# Altium schematic sheet PX4FMUv2.4.6_3.SchDoc
size 282 x 200 mm
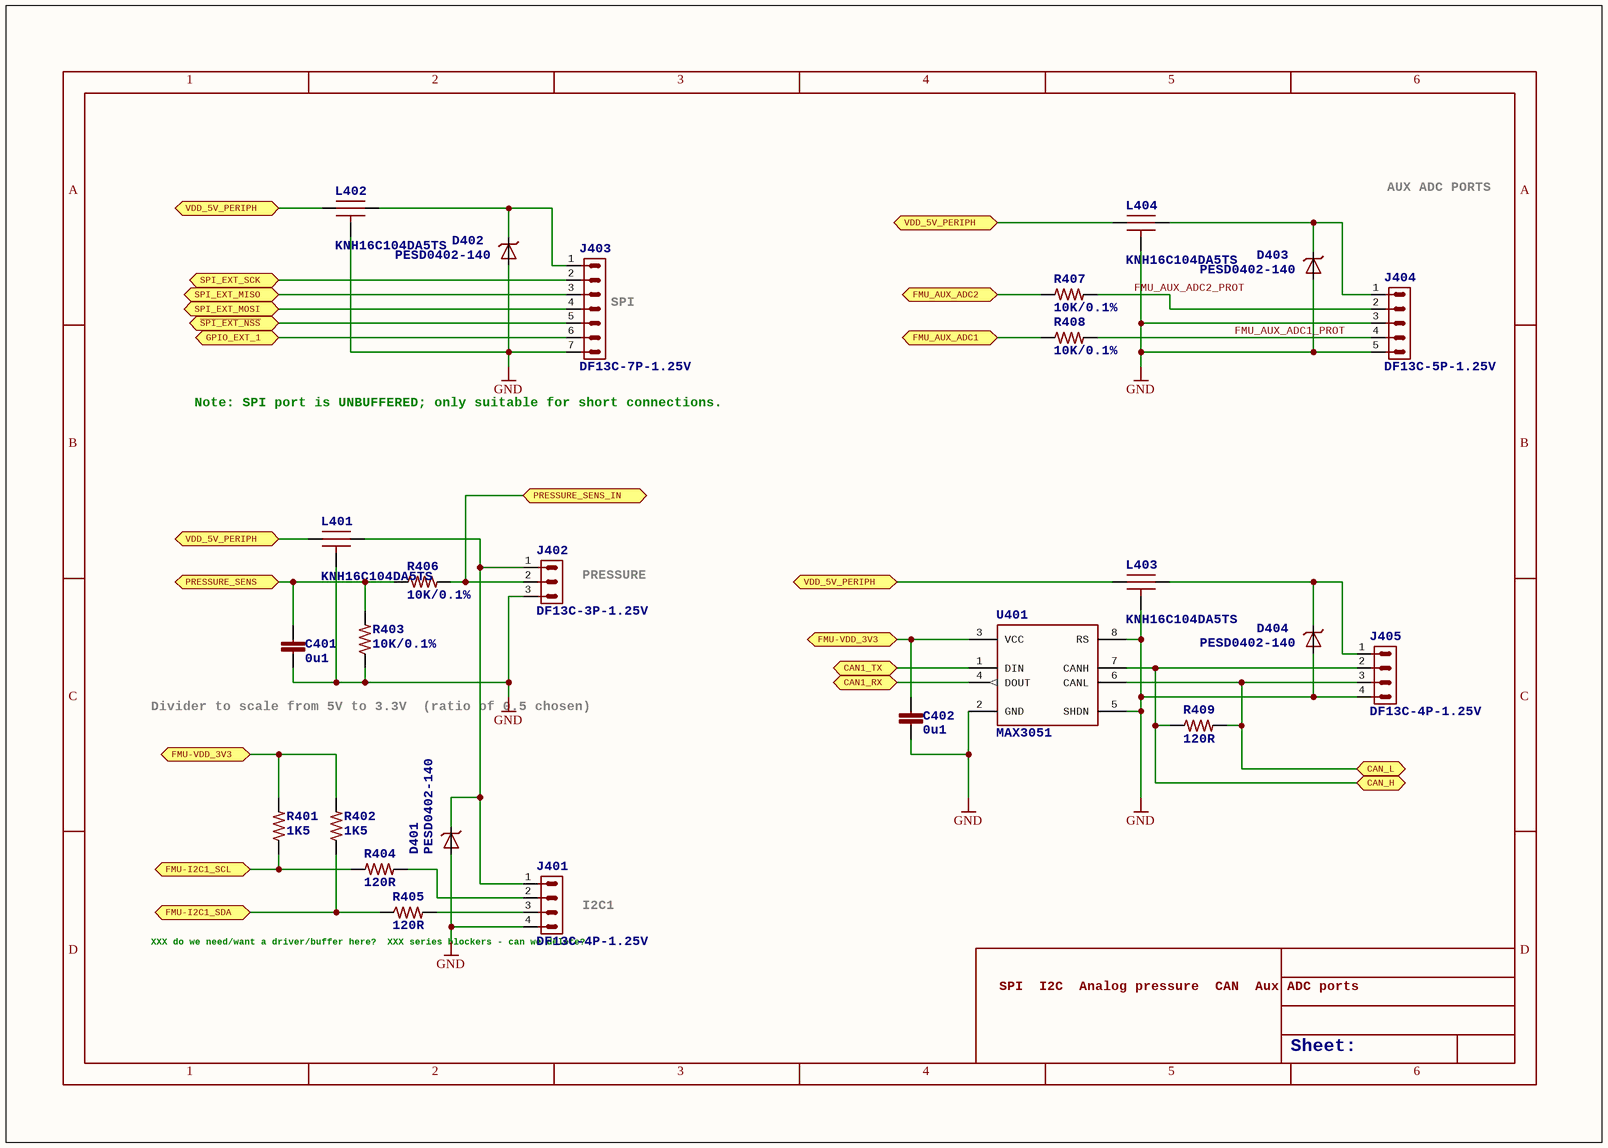
[diagram p0: PX4FMUv2.4.6_3.SchDoc]

## Parts
C401  0u1  [0402-CAP]
C402  0u1  [0402-CAP]
D401  PESD0402-140  [0402-TVS]
D402  PESD0402-140  [0402-TVS]
D403  PESD0402-140  [0402-TVS]
D404  PESD0402-140  [0402-TVS]
J401  DF13C-4P-1.25V  [DF13C-4P-1.25V]
J402  DF13C-3P-1.25V  [DF13C-3P-1.25V]
J403  DF13C-7P-1.25V  [DF13C-7P-1.25V]
J404  DF13C-5P-1.25V  [DF13C-5P-1.25V]
J405  DF13C-4P-1.25V  [DF13C-4P-1.25V]
L401  KNH16C104DA5TS  [KYOCERA-KNH16-DA]
L402  KNH16C104DA5TS  [KYOCERA-KNH16-DA]
L403  KNH16C104DA5TS  [KYOCERA-KNH16-DA]
L404  KNH16C104DA5TS  [KYOCERA-KNH16-DA]
R401  1K5  [0402-RES]
R402  1K5  [0402-RES]
R403  10K/0.1%  [0402-RES]
R404  120R  [0402-RES]
R405  120R  [0402-RES]
R406  10K/0.1%  [0402-RES]
R407  10K/0.1%  [0402-RES]
R408  10K/0.1%  [0402-RES]
R409  120R  [0402-RES]
U401  MAX3051  [SOT23-8]

## Ports
CAN1_RX, CAN1_TX, CAN_H, CAN_L, FMU-I2C1_SCL, FMU-I2C1_SDA, FMU-VDD_3V3, FMU_AUX_ADC1, FMU_AUX_ADC2, GPIO_EXT_1, PRESSURE_SENS, PRESSURE_SENS_IN, SPI_EXT_MISO, SPI_EXT_MOSI, SPI_EXT_SCK, VDD_5V_PERIPH, ~{SPI_EXT_NSS}

## Nets
GND: C401.P$2 C402.P$2 D401.A D402.A D403.A D404.A J401.4 J402.3 J403.7 J404.3 J404.5 J405.4 L401.P$3_P$4_P$5(P$3) L402.P$3_P$4_P$5(P$3) L403.P$3_P$4_P$5(P$3) L404.P$3_P$4_P$5(P$3) R403.P$1 U401.2(GND) U401.5(SHDN) U401.8(RS)
CAN1_RX: U401.4(DOUT) ; port CAN1_RX
CAN1_TX: U401.1(DIN) ; port CAN1_TX
CAN_H: J405.2 R409.P$1 U401.7(CANH) ; port CAN_H
CAN_L: J405.3 R409.P$2 U401.6(CANL) ; port CAN_L
FMU-I2C1_SCL: R401.P$1 R404.P$1 ; port FMU-I2C1_SCL
FMU-I2C1_SDA: R402.P$1 R405.P$1 ; port FMU-I2C1_SDA
FMU-VDD_3V3: C402.P$1 R401.P$2 R402.P$2 U401.3(VCC) ; port FMU-VDD_3V3
FMU_AUX_ADC1: R408.P$1 ; port FMU_AUX_ADC1
FMU_AUX_ADC1_PROT: J404.4 R408.P$2
FMU_AUX_ADC2: R407.P$1 ; port FMU_AUX_ADC2
FMU_AUX_ADC2_PROT: J404.2 R407.P$2
GPIO_EXT_1: J403.6 ; port GPIO_EXT_1
PRESSURE_SENS: C401.P$1 R403.P$2 R406.P$1 ; port PRESSURE_SENS
PRESSURE_SENS_IN: J402.2 R406.P$2 ; port PRESSURE_SENS_IN
~{SPI_EXT_NSS}: J403.5 ; port ~{SPI_EXT_NSS}
SPI_EXT_MISO: J403.3 ; port SPI_EXT_MISO
SPI_EXT_MOSI: J403.4 ; port SPI_EXT_MOSI
SPI_EXT_SCK: J403.2 ; port SPI_EXT_SCK
VDD_5V_PERIPH: L401.P$1 L402.P$1 L403.P$1 L404.P$1 ; port VDD_5V_PERIPH
NetD401_C: D401.C J401.1 J402.1 L401.P$2
NetD402_C: D402.C J403.1 L402.P$2
NetD403_C: D403.C J404.1 L404.P$2
NetD404_C: D404.C J405.1 L403.P$2
NetJ401_2: J401.2 R404.P$2
NetJ401_3: J401.3 R405.P$2

## Notes on the sheet
- AUX ADC PORTS
- (near J403) SPI
- (near J403) Note: SPI port is UNBUFFERED; only suitable for short connections.
- (near J402) PRESSURE
- Divider to scale from 5V to 3.3V
  (ratio of 0.5 chosen)
- XXX do we need/want a driver/buffer here?
  XXX series blockers - can we delete?
- (near J401) I2C1
- SPI
  I2C
  Analog pressure
  CAN
  Aux ADC ports
- Sheet:
- 1
- 2
- 3
- 4
- 5
- 6
- A
- B
- C
- D

## Library data of the parts
C401 C402 = CAP0402: CapacitorStandard 0603 ceramic capacitor, and 0.1" leaded capacitor.; PARTNO: CC0402ZRY5V7BB104
D401-D404 = DIODE-TVS
J401 J405 = DF13-4P-1.25V: DF13-4P 1.25mm Pitch Miniature Crimping Connector.; PARTNO: DF13C-4P-1.25V(20)
J402 = DF13-3P-1.25V: DF13-3P 1.25mm Pitch Miniature Crimping Connector.; PARTNO: DF13C-3P-1.25V(20)
J403 = DF13-7P-1.25V: DF13-7P 1.25mm Pitch Miniature Crimping Connector.; PARTNO: DF13C-7P-1.25V(20)
J404 = DF13-5P-1.25V: DF13-5P 1.25mm Pitch Miniature Crimping Connector.; PARTNO: DF13C-5P-1.25V(20)
L401-L404 = KNH16C104DA5TS: Kyocera KNH16C104DA5TS EMI filter; PARTNO: KNH16C104DA5TS
R401 R402 = RESISTOR0402-RES: ResistorBasic schematic elements and footprints for 0603, 1206, and PTH 1/10th watt (small) resistors.; PARTNO: RC0402FR-071K5L
R403 R406-R408 = RESISTOR0402-RES: ResistorBasic schematic elements and footprints for 0603, 1206, and PTH 1/10th watt (small) resistors.; PARTNO: ERA-2AEB103X
R404 R405 R409 = RESISTOR0402-RES: ResistorBasic schematic elements and footprints for 0603, 1206, and PTH 1/10th watt (small) resistors.; PARTNO: RC0402FR-07120RL
U401 = MAX3051MAX3051EKA: 3.3-V CAN TRANSCEIVER; PARTNO: MAX3051EKA